# EAGLE design ECU_Checker_New (EAGLE 9.5.2)
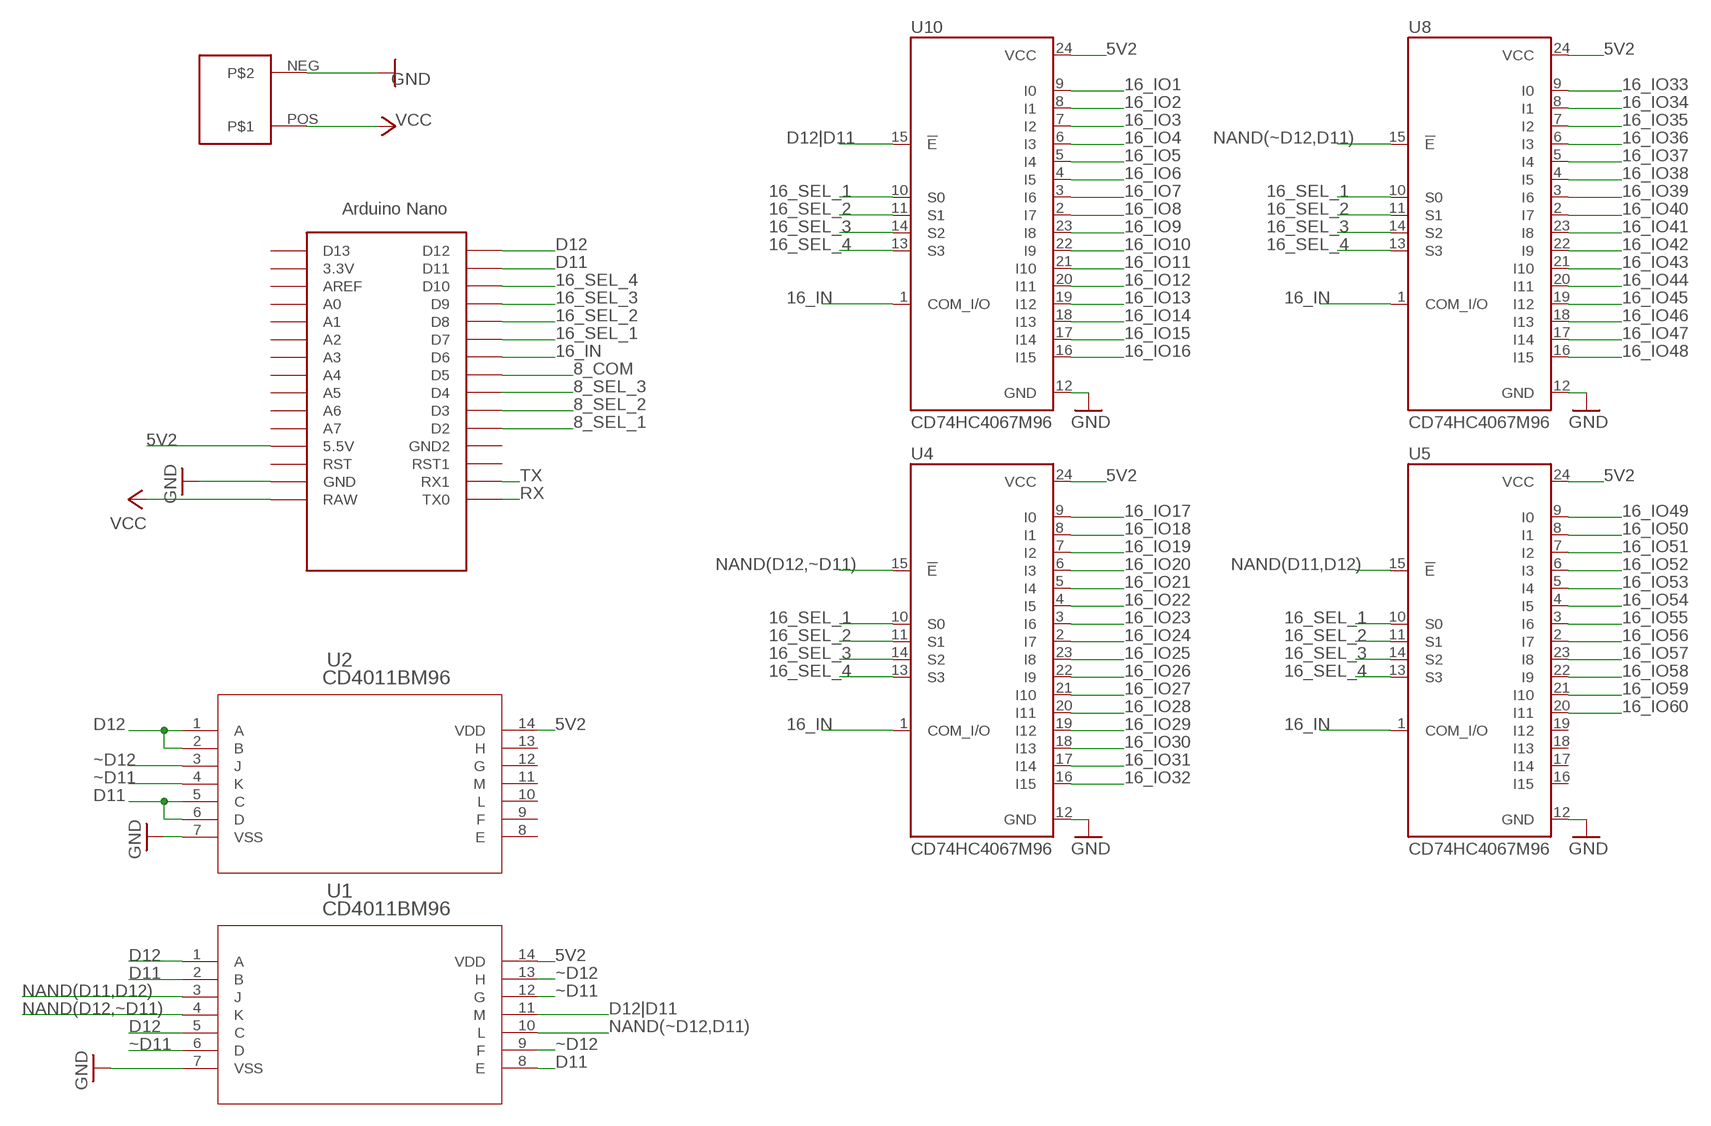
[diagram p0: schematic, sheet 1, part 1 of 2]
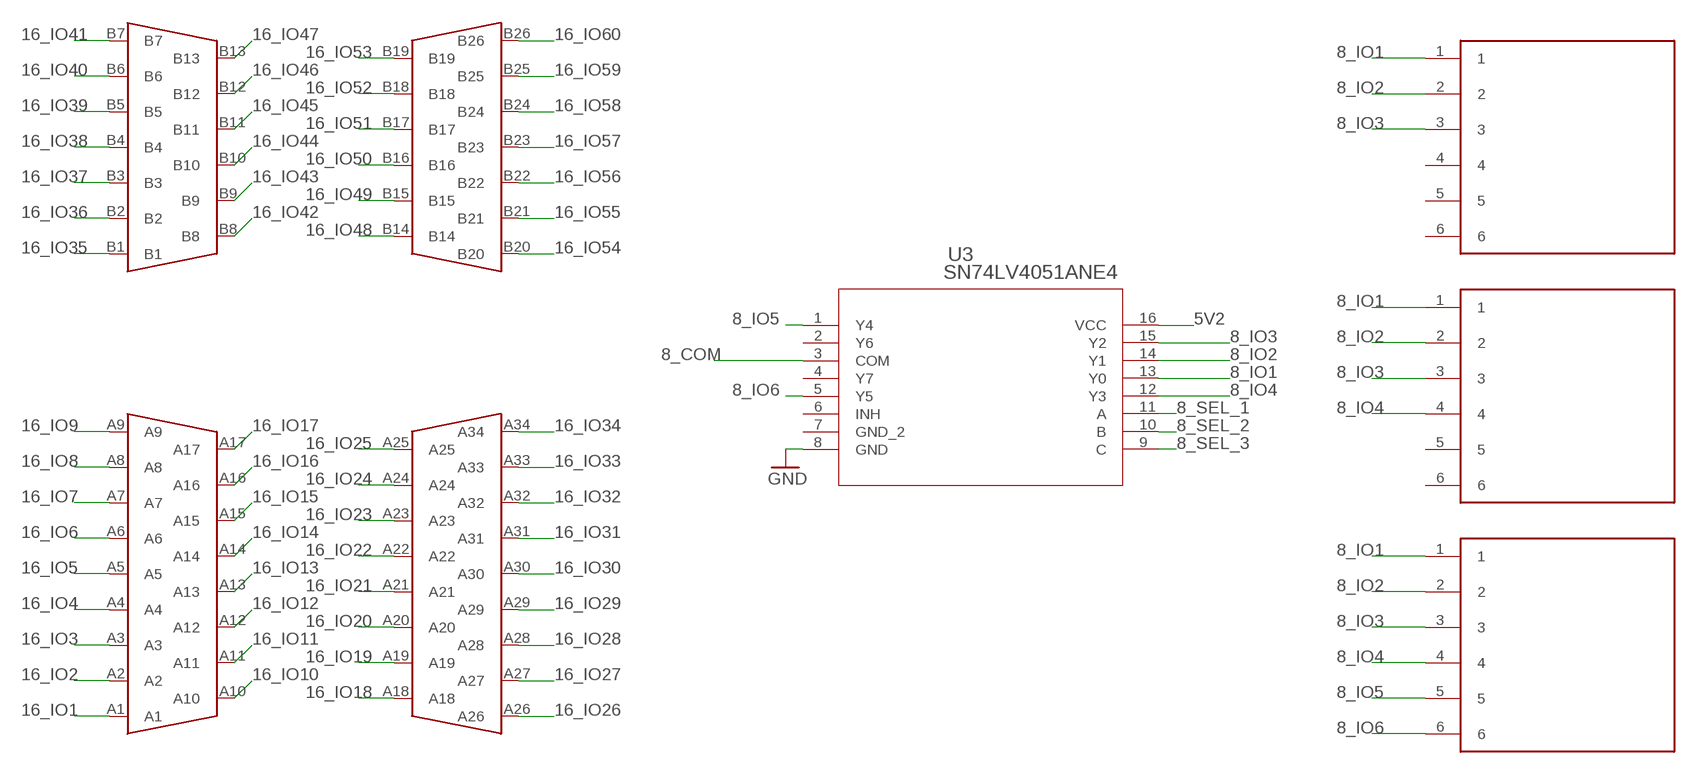
[diagram p1: schematic, sheet 1, part 2 of 2]

## Parts
U1  CD4011BM96  [D14]
U2  CD4011BM96  [D14]
U3  SN74LV4051ANE4  [N16]
U4  CD74HC4067M96  [SOIC127P1030X265-24N]
U5  CD74HC4067M96  [SOIC127P1030X265-24N]
U8  CD74HC4067M96  [SOIC127P1030X265-24N]
U10  CD74HC4067M96  [SOIC127P1030X265-24N]
U$2  NANO  [NANO]
U$3  DTM_CON  [DTM_CON_F]
U$4  BATTERY  [BATTERY_F]
U$5  DTM_CON  [DTM_CON_F]
U$6  DTM_CON  [DTM_CON_F]
U$7  MOTEC_400_CON  [MOTEC_400_CON_F]

## Nets
5V2: U1.14(VDD) U2.14(VDD) U3.16(VCC) U4.24(VCC) U5.24(VCC) U8.24(VCC) U10.24(VCC) U$2.5V(5.5V)
8_COM: U3.3(COM) U$2.D5
8_IO1: U3.13(Y0) U$3.1 U$5.1 U$6.1
8_IO2: U3.14(Y1) U$3.2 U$5.2 U$6.2
8_IO3: U3.15(Y2) U$3.3 U$5.3 U$6.3
8_IO4: U3.12(Y3) U$5.4 U$6.4
8_IO5: U3.1(Y4) U$6.5
8_IO6: U3.5(Y5) U$6.6
8_SEL_1: U3.11(A) U$2.D2
8_SEL_2: U3.10(B) U$2.D3
8_SEL_3: U3.9(C) U$2.D4
16_IN: U4.1(COM_I/O) U5.1(COM_I/O) U8.1(COM_I/O) U10.1(COM_I/O) U$2.D6
16_IO1: U10.9(I0) U$7.A1
16_IO2: U10.8(I1) U$7.A2
16_IO3: U10.7(I2) U$7.A3
16_IO4: U10.6(I3) U$7.A4
16_IO5: U10.5(I4) U$7.A5
16_IO6: U10.4(I5) U$7.A6
16_IO7: U10.3(I6) U$7.A7
16_IO8: U10.2(I7) U$7.A8
16_IO9: U10.23(I8) U$7.A9
16_IO10: U10.22(I9) U$7.A10
16_IO11: U10.21(I10) U$7.A11
16_IO12: U10.20(I11) U$7.A12
16_IO13: U10.19(I12) U$7.A13
16_IO14: U10.18(I13) U$7.A14
16_IO15: U10.17(I14) U$7.A15
16_IO16: U10.16(I15) U$7.A16
16_IO17: U4.9(I0) U$7.A17
16_IO18: U4.8(I1) U$7.A18
16_IO19: U4.7(I2) U$7.A19
16_IO20: U4.6(I3) U$7.A20
16_IO21: U4.5(I4) U$7.A21
16_IO22: U4.4(I5) U$7.A22
16_IO23: U4.3(I6) U$7.A23
16_IO24: U4.2(I7) U$7.A24
16_IO25: U4.23(I8) U$7.A25
16_IO26: U4.22(I9) U$7.A26
16_IO27: U4.21(I10) U$7.A27
16_IO28: U4.20(I11) U$7.A28
16_IO29: U4.19(I12) U$7.A29
16_IO30: U4.18(I13) U$7.A30
16_IO31: U4.17(I14) U$7.A31
16_IO32: U4.16(I15) U$7.A32
16_IO33: U8.9(I0) U$7.A33
16_IO34: U8.8(I1) U$7.A34
16_IO35: U8.7(I2) U$7.B1
16_IO36: U8.6(I3) U$7.B2
16_IO37: U8.5(I4) U$7.B3
16_IO38: U8.4(I5) U$7.B4
16_IO39: U8.3(I6) U$7.B5
16_IO40: U8.2(I7) U$7.B6
16_IO41: U8.23(I8) U$7.B7
16_IO42: U8.22(I9) U$7.B8
16_IO43: U8.21(I10) U$7.B9
16_IO44: U8.20(I11) U$7.B10
16_IO45: U8.19(I12) U$7.B11
16_IO46: U8.18(I13) U$7.B12
16_IO47: U8.17(I14) U$7.B13
16_IO48: U8.16(I15) U$7.B14
16_IO49: U5.9(I0) U$7.B15
16_IO50: U5.8(I1) U$7.B16
16_IO51: U5.7(I2) U$7.B17
16_IO52: U5.6(I3) U$7.B18
16_IO53: U5.5(I4) U$7.B19
16_IO54: U5.4(I5) U$7.B20
16_IO55: U5.3(I6) U$7.B21
16_IO56: U5.2(I7) U$7.B22
16_IO57: U5.23(I8) U$7.B23
16_IO58: U5.22(I9) U$7.B24
16_IO59: U5.21(I10) U$7.B25
16_IO60: U5.20(I11) U$7.B26
16_SEL_1: U4.10(S0) U5.10(S0) U8.10(S0) U10.10(S0) U$2.D7
16_SEL_2: U4.11(S1) U5.11(S1) U8.11(S1) U10.11(S1) U$2.D8
16_SEL_3: U4.14(S2) U5.14(S2) U8.14(S2) U10.14(S2) U$2.D9
16_SEL_4: U4.13(S3) U5.13(S3) U8.13(S3) U10.13(S3) U$2.D10
D11: U1.2(B) U1.8(E) U2.5(C) U2.6(D) U$2.D11
D12: U1.1(A) U1.5(C) U2.1(A) U2.2(B) U$2.D12
D12|D11: U1.11(M) U10.15(!E)
GND: U1.7(VSS) U2.7(VSS) U3.8(GND) U4.12(GND) U5.12(GND) U8.12(GND) U10.12(GND) U$2.GND U$4.NEG
NAND(D11,D12): U1.3(J) U5.15(!E)
NAND(D12,~D11): U1.4(K) U4.15(!E)
NAND(~D12,D11): U1.10(L) U8.15(!E)
RX: U$2.TX0
TX: U$2.RX1
VCC: U$2.RAW U$4.POS
~D11: U1.6(D) U1.12(G) U2.4(K)
~D12: U1.9(F) U1.13(H) U2.3(J)
Unconnected: U2.8(E) U2.9(F) U2.10(L) U2.11(M) U2.12(G) U2.13(H) U3.2(Y6) U3.4(Y7) U3.6(INH) U5.16(I15) U5.17(I14) U5.18(I13) U5.19(I12) U$2.3.3V U$2.A0 U$2.A1 U$2.A2 U$2.A3 U$2.A4 U$2.A5 U$2.A6 U$2.A7 U$2.AREF U$2.D13 U$2.GND1(GND2) U$2.ICSP1 U$2.ICSP2 U$2.ICSP3 U$2.ICSP4 U$2.ICSP5 U$2.ICSP6 U$2.RST U$2.RST1 U$3.4 U$3.5 U$3.6 U$5.5 U$5.6

## Power pins joined to a net without a drawn wire
GND_2: U3.7(GND_2)

## Library data of the parts
U1 U2 = CD4011BM96:CD4011BM96; MANUFACTURER_PART_NUMBER: CD4011BM96; VENDOR: Texas Instruments
U3 = SN74LV4051ANE4:SN74LV4051ANE4; MANUFACTURER_PART_NUMBER: SN74LV4051ANE4; VENDOR: Texas Instruments
U4 U5 U8 U10 = CD74HC4067M96:CD74HC4067M96: High Speed CMOS 16-Channel Analog Multiplexer/Demultiplexer 24-SOIC -55 to 125; AVAILABILITY: Unavailable; DESCRIPTION: High Speed CMOS 16-Channel Analog Multiplexer/Demultiplexer 24-SOIC -55 to 125; MF: Texas Instruments; MP: CD74HC4067M96; PACKAGE: SOIC-24 Texas Instruments; PRICE: None
U$2 = Arduino-clone:NANO: Arduino Nano
U$3 U$5 U$6 = ECU_CHECK_LIB:DTM_CON
U$4 = ECU_CHECK_LIB:BATTERY
U$7 = ECU_CHECK_LIB:MOTEC_400_CON

## Board
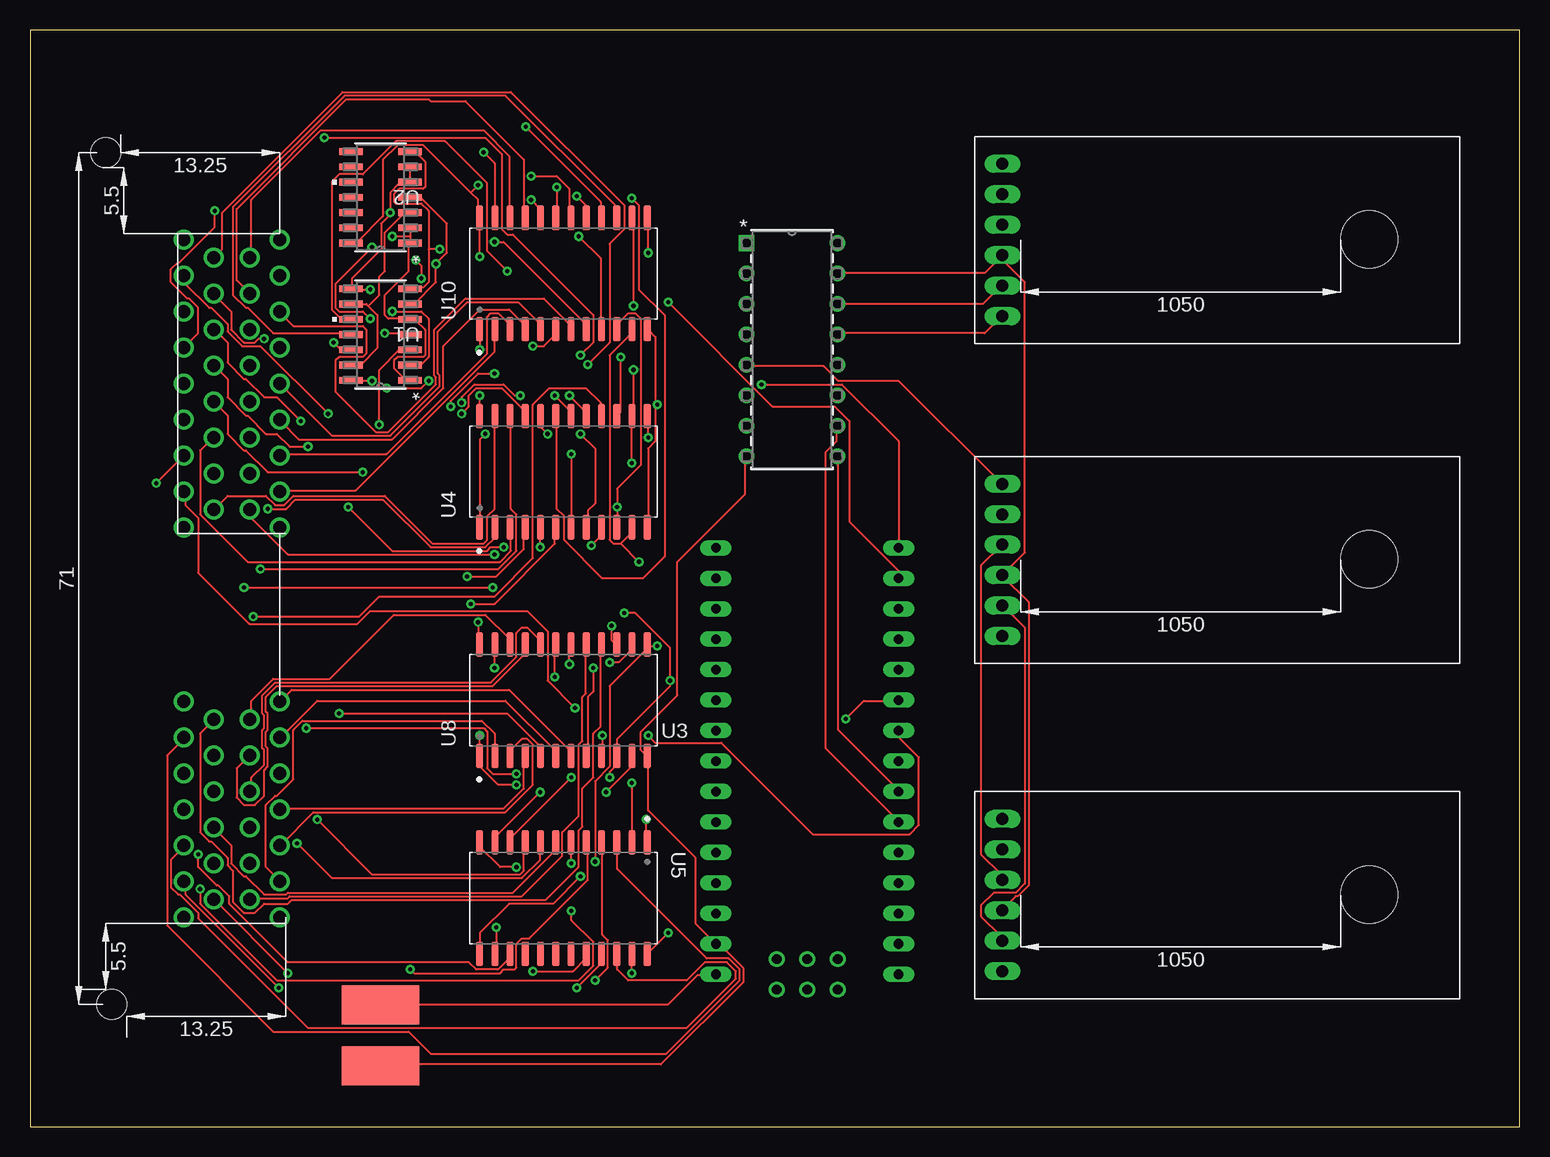
[diagram p2: board, top side]
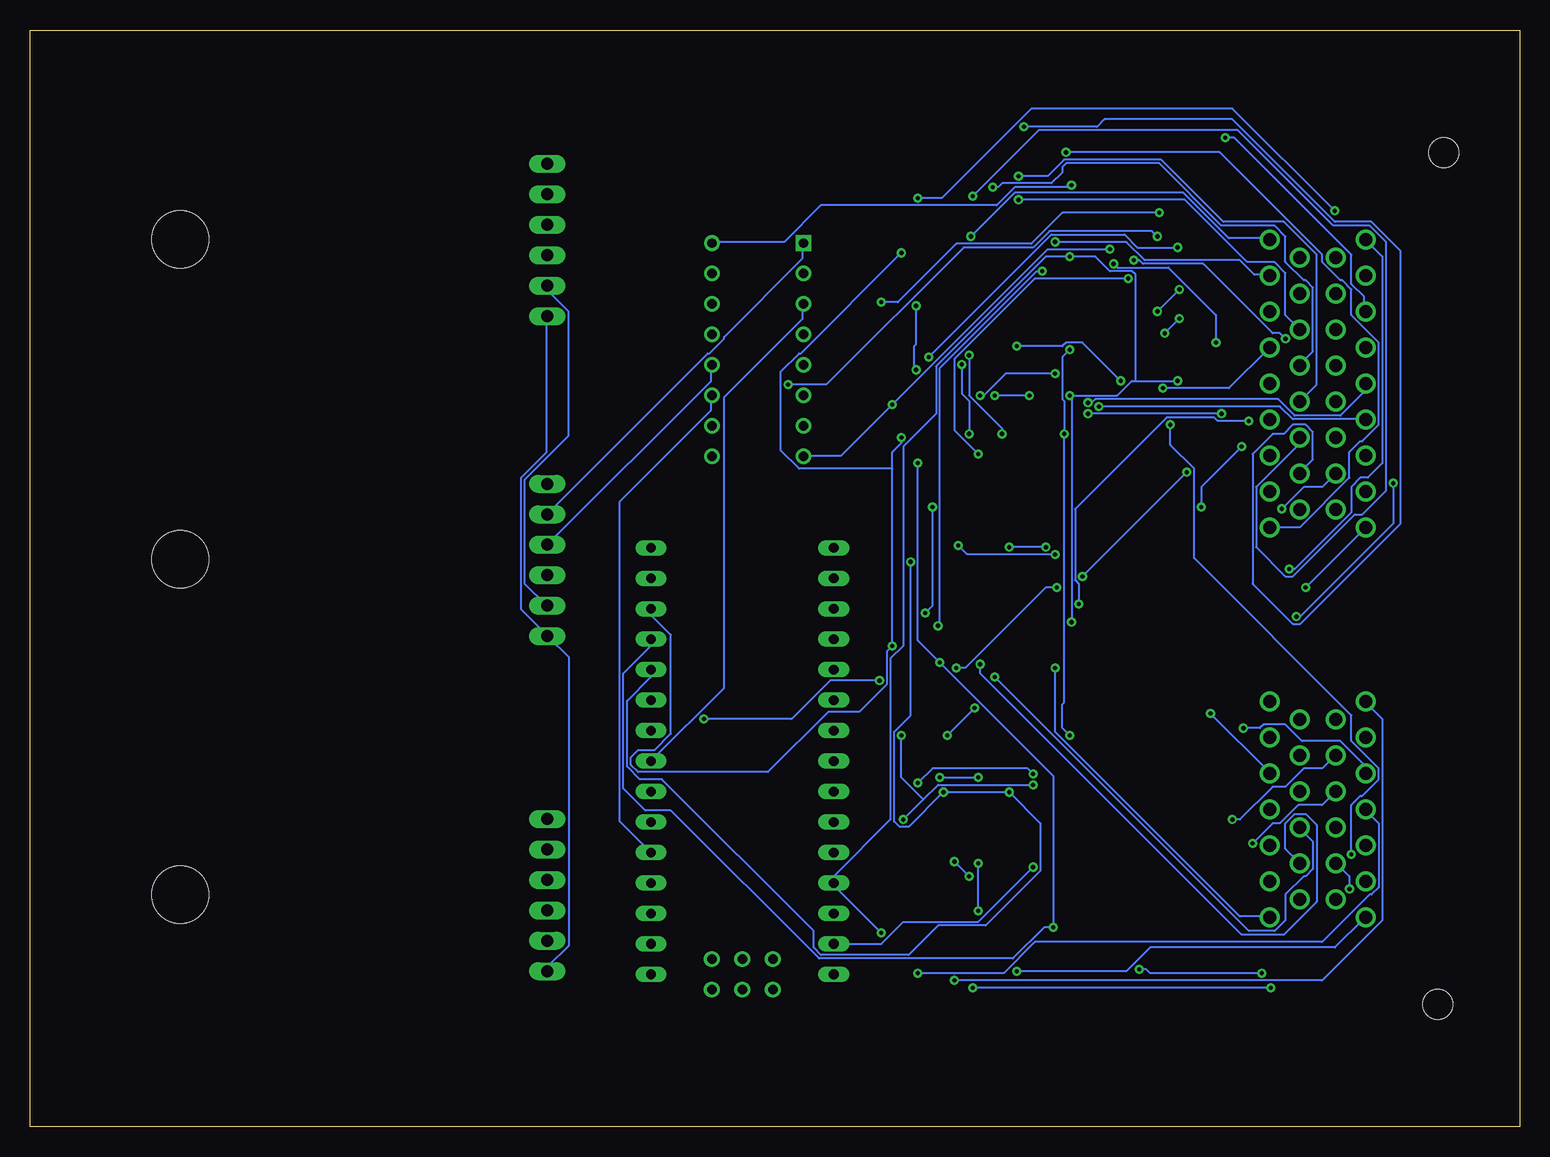
[diagram p3: board, bottom side, seen from below]

Size 124.13 x 91.43 mm. Coordinates in mm from the lower left corner, seen from the top.
Outline: 0,0 124.13,0 124.13,91.43 0,91.43 0,0
Copper layers (1*16): Top 0.035mm / dielectric 1.5mm / Bottom 0.035mm
Design rules "default": minimum track width 6mil, minimum drill 0.35mm, track to track 6mil, track to pad 6mil, pad to pad 6mil, via to via 6mil, smd to smd 6mil, copper to edge 40mil, drill to drill 6mil, minimum pad ring 10mil, minimum via ring 8mil, stop-mask expansion 4mil, vias tented up to drill 0mil, thermal gap 10mil

### Footprints (pad centres in the part's own frame; a part is rotated, then mirrored left to right if it is on the bottom)
D14 = smd 1.981 x 0.559: 1 -2.464,3.81; 2 -2.464,2.54; 3 -2.464,1.27; 4 -2.464,0; 5 -2.464,-1.27; 6 -2.464,-2.54; 7 -2.464,-3.81; 8 2.464,-3.81; 9 2.464,-2.54; 10 2.464,-1.27; 11 2.464,0; 12 2.464,1.27; 13 2.464,2.54; 14 2.464,3.81
N16 = drill 0.787 pad 1.295 square: 1 -7.62,17.78 | drill 0.787 pad 1.295: 2 -7.62,15.24; 3 -7.62,12.7; 4 -7.62,10.16; 5 -7.62,7.62; 6 -7.62,5.08; 7 -7.62,2.54; 8 -7.62,0; 9 0,0; 10 0,2.54; 11 0,5.08; 12 0,7.62; 13 0,10.16; 14 0,12.7; 15 0,15.24; 16 0,17.78
SOIC127P1030X265-24N = smd 2.06 x 0.6: 1 -4.64,6.985; 2 -4.64,5.715; 3 -4.64,4.445; 4 -4.64,3.175; 5 -4.64,1.905; 6 -4.64,0.635; 7 -4.64,-0.635; 8 -4.64,-1.905; 9 -4.64,-3.175; 10 -4.64,-4.445; 11 -4.64,-5.715; 12 -4.64,-6.985; 13 4.64,-6.985; 14 4.64,-5.715; 15 4.64,-4.445; 16 4.64,-3.175; 17 4.64,-1.905; 18 4.64,-0.635; 19 4.64,0.635; 20 4.64,1.905; 21 4.64,3.175; 22 4.64,4.445; 23 4.64,5.715; 24 4.64,6.985
NANO = drill 0.8 long: 3.3V -10.16,24.13; 5V -10.16,-1.27; A0 -10.16,19.05; A1 -10.16,16.51; A2 -10.16,13.97; A3 -10.16,11.43; A4 -10.16,8.89; A5 -10.16,6.35; A6 -10.16,3.81; A7 -10.16,1.27; AREF -10.16,21.59; D2 5.08,1.27; D3 5.08,3.81; D4 5.08,6.35; D5 5.08,8.89; D6 5.08,11.43; D7 5.08,13.97; D8 5.08,16.51; D9 5.08,19.05; D10 5.08,21.59; D11 5.08,24.13; D12 5.08,26.67; D13 -10.16,26.67; GND -10.16,-6.35; GND1 5.08,-1.27; RAW -10.16,-8.89; RST -10.16,-3.81; RST1 5.08,-3.81; RX1 5.08,-6.35; TX0 5.08,-8.89 | drill 0.8: ICSP1 -5.08,-10.16; ICSP2 -5.08,-7.62; ICSP3 -2.54,-10.16; ICSP4 -2.54,-7.62; ICSP5 0,-10.16; ICSP6 0,-7.62
DTM_CON_F = drill 1 long: 1 19.304,6.096; 2 19.304,3.556; 3 19.304,1.016; 4 19.304,-1.524; 5 19.304,-4.064; 6 19.304,-6.604 | hole 4.763: -11.278,-0.305
BATTERY_F = smd 6.452 x 3.251: NEG 0,-2.54; POS 0,2.54
MOTEC_400_CON_F = drill 1.1: A1 13,-0.5; A2 10,-0.5; A3 7,-0.5; A4 4,-0.5; A5 1,-0.5; A6 -2,-0.5; A7 -5,-0.5; A8 -8,-0.5; A9 -11,-0.5; A10 11.5,2; A11 8.5,2; A12 5.5,2; A13 2.5,2; A14 -0.5,2; A15 -3.5,2; A16 -6.5,2; A17 -9.5,2; A18 11.5,5; A19 8.5,5; A20 5.5,5; A21 2.5,5; A22 -0.5,5; A23 -3.5,5; A24 -6.5,5; A25 -9.5,5; A26 13,7.5; A27 10,7.5; A28 7,7.5; A29 4,7.5; A30 1,7.5; A31 -2,7.5; A32 -5,7.5; A33 -8,7.5; A34 -11,7.5; B1 -25.5,-0.5; B2 -28.5,-0.5; B3 -31.5,-0.5; B4 -34.5,-0.5; B5 -37.5,-0.5; B6 -40.5,-0.5; B7 -43.5,-0.5; B8 -27,2; B9 -30,2; B10 -33,2; B11 -36,2; B12 -39,2; B13 -42,2; B14 -27,5; B15 -30,5; B16 -33,5; B17 -36,5; B18 -39,5; B19 -42,5; B20 -25.5,7.5; B21 -28.5,7.5; B22 -31.5,7.5; B23 -34.5,7.5; B24 -37.5,7.5; B25 -40.5,7.5; B26 -43.5,7.5 | hole 2.5: -50.75,13.5; 20.25,14

### Placement (x,y rotation side)
U1  29.21,66.04 180 top
U2  29.21,77.47 180 top
U3  67.31,55.88 0 top
U4  44.45,54.61 90 top
U5  44.45,19.05 270 top
U8  44.45,35.56 90 top
U10  44.45,71.12 90 top
U$2  67.31,21.59 0 top
U$3  100.33,73.66 180 top
U$4  29.21,7.62 0 top
U$5  100.33,19.05 180 top
U$6  100.33,46.99 180 top
U$7  20.32,60.96 90 top

### Tracks (layer width: path | path; a pad name or v marks a point on that pad's centre or on a via)
5V2  (via drill 0.35)
  Top 0.152: 36.73,77.88 37.34,77.27 37.34,75.89 U10.24 37.49,75.74 v37.49,72.54 | 36.73,77.88 32.77,81.84 30.63,81.84 29.41,80.62 29.41,75.89 27.28,73.76 26.82,73.76 U2.14 | 36.73,77.88 v37.34,78.49 | v53.19,16.15 51.51,14.48 U5.24 | v28.5,62.18 26.82,62.18 U1.14 | v37.49,60.96 37.49,59.28 U4.24 | v37.34,42.06 37.34,40.23 U8.24
  Bottom 0.152: v37.34,78.49 37.49,78.33 42.06,78.33 43.59,76.81 58.22,76.81 61.27,73.76 67.21,73.76 U3.16 | v53.19,16.15 57.15,20.12 U$2.5V 57.15,20.88 52.43,25.6 52.43,39.01 51.36,40.08 51.36,56.69 48.62,59.44 48.62,63.4 39.47,72.54 v37.49,72.54 35.36,72.54 34.14,71.32 32.31,71.32 32,71.02 32,62.18 | 32,62.18 32.31,62.18 33.53,60.96 37.34,60.96 | 32,62.18 v28.5,62.18 | 37.34,60.96 v37.34,42.06 | 37.34,60.96 v37.49,60.96
8_COM
  Bottom 0.152: U$2.D5 66.29,36.58 66.29,60.81 59.74,67.36 59.74,68.58 U3.3
8_IO1
  Top 0.152: U3.13 67.36,66.14 79.55,66.14 80.92,67.51 U$3.1
  Bottom 0.152: U$5.1 80.92,12.95 80.92,13.41 79.25,15.09 79.25,39.17 80.92,40.84 U$6.1 81.08,41 83.21,43.13 83.21,54.1 81.08,56.24 81.08,67.51 U$3.1
8_IO2
  Top 0.152: U3.14 79.4,68.58 80.92,70.1 U$3.2 | U$5.2 80.92,15.54 80.92,15.85 79.25,17.53 79.25,18.44 80.31,19.51 82.14,19.51 82.91,20.27 82.91,41.6 81.08,43.43 U$6.2
  Bottom 0.152: U$3.2 80.92,70.1 80.92,69.65 79.25,67.97 79.25,57.61 82.91,53.95 82.91,45.26 81.08,43.43 U$6.2
8_IO3
  Top 0.152: U3.15 67.36,71.17 79.55,71.17 U$3.3 81.08,72.54 81.08,72.24 82.91,70.41 82.91,47.85 U$6.3 81.08,45.87 83.21,43.74 83.21,20.12 82.3,19.2 82.14,19.2 81.08,18.14 U$5.3
8_IO4
  Top 0.152: U$5.4 80.92,20.57 80.92,21.03 79.25,22.71 79.25,46.79 80.92,48.46 U$6.4
  Bottom 0.152: U$6.4 67.36,62.18 67.36,63.4 U3.12
8_IO5
  Bottom 0.152: U3.1 59.74,73.61 59.74,72.39 66.29,65.84 66.29,65.68 67.51,64.47 67.67,64.47 81.08,51.05 U$6.5
8_IO6
  Top 0.152: U3.5 59.74,63.4 66.14,63.4 67.36,62.18 72.39,62.18 80.92,53.65 U$6.6
8_SEL_1
  Bottom 0.152: U$2.D2 74.98,25.45 74.98,52.12 67.36,59.74 67.36,60.96 U3.11
8_SEL_2
  Top 0.152: U3.10 67.21,58.37 67.21,57.15 66.29,56.24 66.29,31.55 72.39,25.45 U$2.D3
8_SEL_3
  Top 0.152: U3.9 67.36,55.78 67.36,33.07 72.39,28.04 U$2.D4
16_IN  (via drill 0.35)
  Top 0.152: v37.95,57.76 37.49,57.3 37.49,49.99 U4.1 | v37.49,64.77 37.49,66.45 U10.1 | v40.54,28.5 39.01,28.5 37.49,30.02 37.49,30.79 U8.1 37.49,30.94 v37.49,32.61 | v51.36,25.6 51.36,23.77 U5.1 | U$2.D6 72.39,32.46 74.07,30.79 74.07,25.15 73.3,24.38 65.23,24.38 57.61,32 52.12,32 v51.51,32.61
  Bottom 0.152: v37.49,64.77 38.1,64.16 38.1,60.66 37.95,60.5 v37.95,57.76 37.95,35.36 38.1,35.2 38.1,33.22 v37.49,32.61 | v40.54,28.5 48.46,28.5 49.68,27.28 | v51.36,25.6 49.68,27.28 | v51.51,32.61 51.51,29.11 49.68,27.28
16_IO1  (via drill 0.35)
  Top 0.152: v45.72,74.22 47.55,72.39 47.55,66.6 U10.9
  Bottom 0.152: v45.72,74.22 42.06,77.88 28.04,77.88 24.23,74.07 20.88,74.07 U$7.A1
16_IO2  (via drill 0.35)
  Top 0.152: v38.71,73.76 39.47,73.76 46.33,66.9 46.33,66.6 U10.8
  Bottom 0.152: v38.71,73.76 32.77,73.76 31.24,72.24 23.32,72.24 22.1,71.02 20.88,71.02 U$7.A2
16_IO3
  Top 0.152: U10.7 44.96,66.6 44.96,66.9 42.82,69.04 36.27,69.04 33.68,66.45 33.68,62.64 33.83,62.48 33.83,61.87 29.87,57.91 28.8,57.91 25.45,61.27 25.45,63.86 25.76,64.16 27.74,64.16 28.04,64.47 28.04,66.45 27.74,66.75 21.95,66.75 20.88,67.82 U$7.A3
16_IO4  (via drill 0.35)
  Top 0.152: v41.91,65.08 42.82,65.08 43.74,65.99 43.74,66.45 U10.6 | v33.22,62.18 32.61,61.57 v29.72,61.57
  Bottom 0.152: v41.91,65.08 38.1,65.08 37.8,65.38 36.42,65.38 v33.22,62.18 | v29.72,61.57 24.23,61.57 20.88,64.92 U$7.A4
16_IO5
  Top 0.152: U10.5 42.52,66.6 42.52,66.9 40.69,68.73 36.42,68.73 33.98,66.29 33.98,62.79 34.14,62.64 34.14,61.72 30.02,57.61 25.15,57.61 20.88,61.87 U$7.A5
16_IO6
  Top 0.152: U10.4 41.15,66.6 41.15,66.9 39.93,68.12 37.49,68.12 34.44,65.08 34.44,61.57 30.18,57.3 22.4,57.3 20.88,58.83 U$7.A6
16_IO7
  Top 0.152: U10.3 39.93,66.6 39.93,66.9 39.01,67.82 38.41,67.82 38.1,67.51 38.1,64.47 29.72,56.08 20.88,56.08 U$7.A7
16_IO8
  Top 0.152: U10.2 38.71,66.45 38.71,64.62 27.13,53.03 20.88,53.03 U$7.A8
16_IO9  (via drill 0.35)
  Top 0.152: v37.8,81.23 38.71,80.31 38.71,75.89 U10.23
  Bottom 0.152: v37.8,81.23 24.99,81.23 16.46,72.69 16.46,72.08 14.94,70.56 14.78,70.56 14.02,69.8 14.02,67.67 11.73,65.38 11.73,58.52 13.11,57.15 13.26,57.15 14.17,56.24 14.17,54.1 18.29,49.99 20.73,49.99 U$7.A9
16_IO10
  Top 0.152: U10.22 39.93,75.89 39.93,80.92 37.8,83.06 24.23,83.06 18.44,77.27 18.44,72.54 U$7.A10
16_IO11
  Top 0.152: U10.21 41.15,75.89 41.15,80.62 36.27,85.5 33.38,85.5 33.22,85.65 26.36,85.65 17.22,76.5 17.22,70.56 18.29,69.49 U$7.A11
16_IO12  (via drill 0.35)
  Top 0.152: v41.76,77.27 42.52,76.5 42.52,75.89 U10.20
  Bottom 0.152: v41.76,77.27 27.89,77.27 22.71,72.08 20.42,72.08 19.51,71.17 19.51,67.67 18.44,66.6 U$7.A12
16_IO13  (via drill 0.35)
  Top 0.152: v43.89,78.33 43.89,75.89 U10.19
  Bottom 0.152: v43.89,78.33 43.43,78.33 43.13,78.64 39.01,78.64 38.1,79.55 38.1,80.01 37.8,80.31 30.02,80.31 24.84,75.13 20.42,75.13 19.51,74.22 19.51,72.08 17.98,70.56 17.83,70.56 17.22,69.95 17.22,64.62 18.29,63.55 U$7.A13
16_IO14  (via drill 0.35)
  Top 0.152: v41.76,79.25 43.89,79.25 44.96,78.18 44.96,75.89 U10.18
  Bottom 0.152: v41.76,79.25 39.32,79.25 37.95,80.62 29.87,80.62 24.69,75.44 19.66,75.44 16.92,72.69 16.92,61.87 18.29,60.5 U$7.A14
16_IO15  (via drill 0.35)
  Top 0.152: v45.57,77.57 46.33,76.81 46.33,75.89 U10.17
  Bottom 0.152: v45.57,77.57 40.08,83.06 23.47,83.06 15.54,75.13 12.5,75.13 11.12,73.76 11.12,53.03 13.11,51.05 13.72,51.05 18.9,45.87 19.51,45.87 21.95,48.31 21.95,53.34 18.44,56.84 18.44,57.45 U$7.A15
16_IO16  (via drill 0.35)
  Top 0.152: v41.3,83.36 47.55,77.11 47.55,75.89 U10.16
  Bottom 0.152: v41.3,83.36 35.2,83.36 34.59,83.97 23.93,83.97 15.39,75.44 12.34,75.44 9.91,73 9.91,50.29 18.29,41.91 18.9,41.91 22.25,45.26 22.25,56.08 20.57,57.76 19.66,57.76 18.9,58.52 17.83,58.52 17.22,57.91 17.22,55.63 18.29,54.56 U$7.A16
16_IO17  (via drill 0.35)
  Top 0.152: v46.79,48.46 47.55,49.23 47.55,49.84 U4.9 | v38.71,47.7 21.49,47.7 18.44,50.75 18.44,51.36 U$7.A17
  Bottom 0.152: v46.79,48.46 46.02,47.7 v38.71,47.7
16_IO18  (via drill 0.35)
  Top 0.152: v45.87,57.76 47.09,56.54 47.09,51.97 46.48,51.36 46.48,49.99 U4.8 | v46.48,63.55 48.31,65.38 48.31,73.61 49.53,74.83 49.53,76.81 40.08,86.26 26.06,86.26 16,76.2 16,73.15 15.39,72.54 U$7.A18
  Bottom 0.152: v45.87,57.76 45.87,60.5 46.48,61.11 v46.48,63.55
16_IO19  (via drill 0.35)
  Top 0.152: v45.11,56.08 45.11,49.99 U4.7 | v32.61,70.71 32.61,71.78 v32.16,72.24 | v19.51,65.68 19.05,65.68 18.75,65.38 17.83,65.38 16.76,66.45 16.76,67.97 15.39,69.34 U$7.A19
  Bottom 0.152: v45.11,56.08 47.09,58.06 47.09,64.01 40.39,70.71 v32.61,70.71 | v32.16,72.24 31.7,72.24 31.39,71.93 26.36,71.93 20.57,66.14 19.96,66.14 v19.51,65.68
16_IO20  (via drill 0.35)
  Top 0.152: v36.73,43.59 38.71,43.59 43.74,48.62 43.74,49.84 U4.6 | v22.55,58.83 20.57,60.81 19.51,60.81 17.98,62.33 17.83,62.33 16.46,63.7 16.46,65.38 15.39,66.45 U$7.A20
  Bottom 0.152: v36.73,43.59 36.73,45.26 37.03,45.57 37.03,51.51 29.41,59.13 25.45,59.13 25.15,58.83 v22.55,58.83
16_IO21  (via drill 0.35)
  Top 0.152: v42.52,48.31 42.52,49.84 U4.5 | v39.47,48.31 38.41,48.31 38.1,48.01 30.18,48.01 v26.52,51.66 | v23.16,56.69 21.64,56.69 20.57,57.76 19.66,57.76 18.14,59.28 17.98,59.28 16.46,60.81 16.46,62.33 15.39,63.4 U$7.A21
  Bottom 0.152: v39.47,48.31 v42.52,48.31 | v26.52,51.66 26.52,53.34 v23.16,56.69
16_IO22  (via drill 0.35)
  Top 0.152: v36.42,45.87 38.86,45.87 41.15,48.16 41.15,49.84 U4.4 | v27.74,54.56 19.81,54.56 17.98,56.39 17.83,56.39 16.46,57.76 16.46,59.28 15.39,60.35 U$7.A22
  Bottom 0.152: v27.74,54.56 v36.42,45.87
16_IO23
  Top 0.152: U4.3 40.08,49.84 40.08,48.01 39.17,47.09 18.14,47.09 14.17,51.05 14.17,56.39 15.24,57.45 U$7.A23
16_IO24  (via drill 0.35)
  Top 0.152: v19.81,51.51 21.34,51.51 22.1,52.27 29.41,52.27 33.38,48.31 37.95,48.31 38.71,49.07 38.71,49.84 U4.2
  Bottom 0.152: v19.81,51.51 17.98,53.34 16.46,53.34 15.39,54.41 U$7.A24
16_IO25
  Top 0.152: U4.23 38.71,59.13 38.71,51.51 38.1,50.9 38.1,48.92 37.8,48.62 33.53,48.62 29.57,52.58 21.95,52.58 21.18,51.82 20.42,51.82 19.66,52.58 16.46,52.58 15.39,51.51 U$7.A25
16_IO26  (via drill 0.35)
  Top 0.152: v19.2,46.48 39.01,46.48 40.54,48.01 40.54,51.05 40.08,51.51 40.08,59.13 U4.22
  Bottom 0.152: v19.2,46.48 18.75,46.48 14.02,51.21 14.02,53.34 13.26,54.1 12.65,54.1 11.43,55.32 11.43,72.54 12.8,73.91 U$7.A26
16_IO27  (via drill 0.35)
  Top 0.152: v35.97,59.44 36.58,60.05 36.58,60.96 37.19,61.57 39.32,61.57 41.15,59.74 41.15,59.28 U4.21 | v24.84,59.44 19.2,65.08 17.68,65.08 16.46,66.29 16.46,66.9 15.09,68.28 14.94,68.28 12.95,70.26 12.95,70.87 U$7.A27
  Bottom 0.152: v24.84,59.44 v35.97,59.44
16_IO28  (via drill 0.35)
  Top 0.152: v43.13,57.76 42.67,58.22 42.67,59.13 U4.20 | v45.87,64.31 46.94,65.38 46.94,67.67 40.23,74.37 39.78,74.37 39.32,74.83 39.32,81.08 37.95,82.45 v24.54,82.45
  Bottom 0.152: v43.13,57.76 43.13,58.22 45.87,60.96 v45.87,64.31 | v24.54,82.45 23.77,82.45 14.02,72.69 14.02,70.26 12.95,69.19 12.95,67.97 U$7.A28
16_IO29  (via drill 0.35)
  Top 0.152: v50.14,77.42 50.75,76.81 50.75,69.8 52.88,67.67 52.88,47.55 51.05,45.72 47.7,45.72 44.5,48.92 44.5,50.9 43.89,51.51 43.89,59.13 U4.19 | v15.39,76.35 15.39,74.98 12.5,72.08 12.34,72.08 11.73,71.48 11.73,70.41 13.11,69.04 13.26,69.04 14.02,68.28 14.02,66.14 12.95,65.08 U$7.A29
  Bottom 0.152: v50.14,77.42 48.16,77.42 40.69,84.89 23.93,84.89 v15.39,76.35
16_IO30  (via drill 0.35)
  Top 0.152: v43.74,60.96 44.96,59.74 44.96,59.28 U4.18 | v40.84,60.96 40.39,60.96 39.47,61.87 37.03,61.87 35.97,60.81 v35.97,60.35
  Bottom 0.152: v40.84,60.96 v43.74,60.96 | v35.97,60.35 35.66,60.35 35.36,60.66 20.12,60.66 18.75,59.28 14.94,59.28 12.95,61.27 12.95,61.87 U$7.A30
16_IO31  (via drill 0.35)
  Top 0.152: v44.96,60.96 46.33,59.59 46.33,59.28 U4.17 | v38.71,62.79 37.34,62.79 35.05,60.5 v35.05,60.05
  Bottom 0.152: v44.96,60.96 44.65,60.96 42.82,62.79 v38.71,62.79 | v35.05,60.05 19.96,60.05 18.9,58.98 12.95,58.98 U$7.A31
16_IO32  (via drill 0.35)
  Top 0.152: v18.59,42.52 27.43,42.52 29.11,44.2 38.71,44.2 41.91,47.4 41.91,60.2 43.28,61.57 46.33,61.57 47.55,60.35 47.55,59.28 U4.16 | v10.52,53.65 12.8,55.93 U$7.A32
  Bottom 0.152: v18.59,42.52 18.29,42.52 10.52,50.29 v10.52,53.65
16_IO33  (via drill 0.35)
  Top 0.152: v47.7,32.61 47.7,30.94 U8.9 | v45.41,34.9 43.13,37.19 43.13,41.3 41.45,42.98 28.35,42.98 27.28,41.91 18.29,41.91 14.02,46.18 14.02,50.75 12.95,51.82 12.95,52.88 U$7.A33
  Bottom 0.152: v45.41,34.9 v47.7,32.61
16_IO34  (via drill 0.35)
  Top 0.152: v46.94,38.25 46.94,36.27 46.48,35.81 46.48,30.94 U8.8 | v17.83,44.96 v38.56,44.96
  Bottom 0.152: v46.94,38.25 46.18,38.25 39.47,44.96 v38.56,44.96 | v17.83,44.96 12.95,49.84 U$7.A34
16_IO35
  Top 0.152: U8.7 44.96,30.94 44.96,31.39 39.93,36.42 21.79,36.42 20.88,35.51 U$7.B1
16_IO36
  Top 0.152: U8.6 43.74,30.94 43.74,31.39 39.62,35.51 23.93,35.51 20.88,32.46 U$7.B2
16_IO37  (via drill 0.35)
  Top 0.152: v25.76,34.44 39.78,34.44 42.52,31.7 42.52,30.94 U8.5
  Bottom 0.152: v25.76,34.44 20.88,29.57 U$7.B3
16_IO38
  Top 0.152: U8.4 41.15,30.79 41.15,28.19 39.47,26.52 20.88,26.52 U$7.B4
16_IO39
  Top 0.152: U8.3 40.08,30.94 40.08,31.39 41,32.31 41.45,32.31 41.91,31.85 41.91,28.5 39.62,26.21 23.62,26.21 20.88,23.47 U$7.B5
16_IO40
  Top 0.152: U8.2 38.71,30.94 38.71,32.77 37.64,33.83 22.71,33.83 21.95,33.07 21.95,28.96 20.57,27.58 20.42,27.58 19.66,26.82 19.66,21.64 20.73,20.57 U$7.B6
16_IO41  (via drill 0.35)
  Top 0.152: v38.71,38.25 38.71,40.08 U8.23
  Bottom 0.152: v38.71,38.25 38.71,32.92 23.32,17.53 20.88,17.53 U$7.B7
16_IO42
  Top 0.152: U8.22 39.93,40.23 39.93,40.69 37.95,42.67 30.33,42.67 24.99,37.34 20.27,37.34 18.44,35.51 18.44,33.98 U$7.B8
16_IO43
  Top 0.152: U8.21 41.15,40.08 41.15,39.32 38.56,36.73 20.57,36.73 19.66,35.81 19.66,34.59 19.81,34.44 19.81,33.07 19.66,32.92 19.66,31.7 19.81,31.55 19.81,30.02 19.51,29.72 19.51,27.58 18.75,26.82 17.83,26.82 17.22,27.43 17.22,29.87 18.29,30.94 U$7.B9
16_IO44
  Top 0.152: U8.20 42.52,40.23 42.52,40.54 41.45,41.6 41,41.6 40.54,41.15 40.54,39.17 38.41,37.03 20.42,37.03 19.36,35.97 19.36,34.44 19.51,34.29 19.51,33.22 19.36,33.07 19.36,31.55 19.51,31.39 19.51,30.18 18.44,29.11 18.44,28.04 U$7.B10
16_IO45  (via drill 0.35)
  Top 0.152: v43.74,37.49 43.74,40.08 U8.19
  Bottom 0.152: v43.74,37.49 22.55,16.31 20.42,16.31 19.51,17.22 19.51,19.36 17.98,20.88 17.83,20.88 17.22,21.49 17.22,23.77 18.29,24.84 U$7.B11
16_IO46  (via drill 0.35)
  Top 0.152: v44.96,38.56 44.96,40.08 U8.18
  Bottom 0.152: v44.96,38.56 44.96,37.8 23.16,16 19.66,16 16.92,18.75 16.92,25.15 17.83,26.06 18.75,26.06 19.51,25.3 19.51,23.16 18.44,22.1 U$7.B12
16_IO47
  Top 0.152: U8.17 46.33,40.08 46.33,36.12 46.02,35.81 46.02,32.16 45.72,31.85 45.72,25.91 44.35,24.54 44.35,22.55 41,19.2 21.64,19.2 21.49,19.05 18.44,19.05 U$7.B13
16_IO48
  Top 0.152: U8.16 47.55,40.08 47.55,33.38 46.94,32.77 46.94,29.11 46.02,28.19 46.02,24.99 45.72,24.69 45.72,21.64 42.98,18.9 21.79,18.9 21.49,18.59 19.51,18.59 18.75,17.83 17.83,17.83 16.92,18.75 16.92,21.34 16.46,21.79 16.46,22.4 15.09,23.77 14.94,23.77 14.17,24.54 14.17,32.77 15.24,33.83 U$7.B14
16_IO49  (via drill 0.35)
  Top 0.152: v23.93,25.6 28.5,21.03 40.84,21.03 41.15,21.34 41.15,23.62 U5.9
  Bottom 0.152: v23.93,25.6 23.32,25.6 20.57,28.35 19.51,28.35 17.98,29.87 16.46,29.87 15.39,30.94 U$7.B15
16_IO50  (via drill 0.35)
  Top 0.152: v22.25,23.62 25.15,20.73 41,20.73 42.52,22.25 42.52,23.62 U5.8
  Bottom 0.152: v22.25,23.62 20.57,25.3 19.96,25.3 18.44,26.82 16.46,26.82 15.39,27.89 U$7.B16
16_IO51
  Top 0.152: U5.7 43.74,23.62 43.74,23.01 40.23,19.51 21.49,19.51 21.34,19.36 19.51,19.36 17.98,20.88 17.83,20.88 16.76,21.95 16.76,23.47 15.39,24.84 U$7.B17
16_IO52  (via drill 0.35)
  Top 0.152: v45.11,21.95 45.11,23.62 U5.6 | v45.11,17.98 45.11,17.22 46.94,15.39 46.94,13.41 45.72,12.19 20.57,12.19 14.17,18.59 v14.17,19.81
  Bottom 0.152: v45.11,17.98 v45.11,21.95 | v14.17,19.81 14.17,20.88 15.24,21.95 U$7.B18
16_IO53  (via drill 0.35)
  Top 0.152: v31.7,13.11 32,12.8 39.17,12.8 39.47,13.11 40.39,13.11 40.54,13.26 40.54,15.24 41,15.7 41.6,15.7 46.48,20.57 46.48,23.62 U5.5 | v21.49,12.8 15.39,18.9 U$7.B19
  Bottom 0.152: v31.7,13.11 31.09,13.11 30.79,12.8 v21.49,12.8
16_IO54  (via drill 0.35)
  Top 0.152: v47.09,12.19 48.16,13.26 48.16,15.54 47.7,16 47.7,23.62 U5.4
  Bottom 0.152: v47.09,12.19 16.46,12.19 11.43,17.22 11.43,33.98 12.8,35.36 U$7.B20
16_IO55
  Top 0.152: U5.3 48.92,23.62 48.92,21.49 56.39,14.02 58.22,14.02 59.13,13.11 59.13,12.19 53.03,6.1 33.38,6.1 31.55,7.92 20.27,7.92 11.43,16.76 11.43,30.94 12.8,32.31 U$7.B21
16_IO56  (via drill 0.35)
  Top 0.152: v50.14,28.65 50.14,23.77 U5.2 | v40.54,29.41 38.56,29.41 38.1,29.87 38.1,32.92 37.8,33.22 v23.01,33.22
  Bottom 0.152: v50.14,28.65 48.92,29.87 41,29.87 v40.54,29.41 | v23.01,33.22 21.64,33.22 21.34,33.53 19.51,33.53 18.14,32.16 14.94,32.16 12.95,30.18 12.95,29.57 U$7.B22
16_IO57  (via drill 0.35)
  Top 0.152: v50.14,12.8 50.14,14.33 U5.23
  Bottom 0.152: v50.14,12.8 42.98,12.8 40.39,15.39 16.46,15.39 12.5,19.36 12.34,19.36 11.73,19.96 11.73,25.3 12.8,26.36 U$7.B23
16_IO58
  Top 0.152: U5.22 48.92,14.33 48.92,13.11 49.84,12.19 54.71,12.19 56.24,13.72 58.06,13.72 58.83,12.95 58.83,12.34 54.71,8.23 23.16,8.23 14.02,17.37 14.02,17.83 12.5,19.36 12.34,19.36 11.73,19.96 11.73,22.25 12.8,23.32 U$7.B24
16_IO59  (via drill 0.35)
  Top 0.152: v45.57,11.58 47.55,13.56 47.55,14.33 U5.21 | v20.73,11.58 12.95,19.36 12.95,20.42 U$7.B25
  Bottom 0.152: v20.73,11.58 v45.57,11.58
16_IO60  (via drill 0.35)
  Top 0.152: v41.91,12.95 45.26,12.95 46.33,14.02 46.33,14.33 U5.20
  Bottom 0.152: v41.91,12.95 32.77,12.95 30.79,14.94 15.39,14.94 12.95,17.37 U$7.B26
16_SEL_1  (via drill 0.35)
  Top 0.152: U4.10 48.92,49.99 v48.92,51.66 48.92,53.19 50.9,55.17 50.9,67.36 50.44,67.82 49.84,67.82 48.92,66.9 48.92,66.6 U10.10 | v45.11,29.11 40.08,24.08 40.08,23.77 U5.10 | v48.31,29.11 48.31,29.57 48.77,30.02 48.77,30.79 U8.10 48.92,30.94 48.92,32.31 53.34,36.73 v53.34,37.19 53.34,39.93 50.44,42.82 v49.53,42.82 | v67.97,33.98 69.49,35.51 72.39,35.51 U$2.D7
  Bottom 0.152: v48.31,29.11 v45.11,29.11 | v67.97,33.98 60.66,33.98 57.45,37.19 v53.34,37.19 | v48.92,51.66 48.92,43.43 v49.53,42.82
16_SEL_2  (via drill 0.35)
  Top 0.152: 49.23,48.62 50.14,49.53 50.14,49.84 U4.11 | 49.23,48.62 48.62,48.62 48.31,48.92 48.31,64.31 50.14,66.14 50.14,66.45 U10.11 | v42.52,27.89 38.86,24.23 38.86,23.77 U5.11 | v48.01,27.89 50.14,30.02 50.14,30.79 U8.11 | v50.75,47.09 49.23,48.62
  Bottom 0.152: U$2.D8 72.39,37.49 74.37,35.51 74.37,30.02 73.3,28.96 71.48,28.96 58.83,16.31 58.83,14.94 58.22,14.33 50.9,14.33 48.46,16.76 44.5,16.76 39.93,21.34 39.93,25.3 v42.52,27.89 v48.01,27.89 50.9,24.99 51.66,24.99 52.12,25.45 52.12,32.92 50.75,34.29 v50.75,47.09
16_SEL_3  (via drill 0.35)
  Top 0.152: v38.86,16.61 38.86,14.48 U5.14 | v48.31,38.71 49.07,38.71 50.14,39.78 50.14,40.08 U8.14 | v50.14,55.32 50.14,59.13 U4.14 50.29,59.28 v50.29,63.09 | v50.29,68.43 50.29,75.74 U10.14
  Bottom 0.152: v50.14,55.32 50.14,40.54 v48.31,38.71 38.86,29.26 v38.86,16.61 39.62,16.61 42.22,14.02 58.37,14.02 70.71,26.36 72.85,26.36 74.68,28.19 74.68,37.8 72.39,40.08 U$2.D9 | v50.29,68.43 50.29,65.23 50.44,65.08 50.44,63.25 v50.29,63.09
16_SEL_4  (via drill 0.35)
  Top 0.152: v45.87,20.88 43.59,18.59 39.93,18.59 37.49,16.15 37.49,14.48 U5.13 | v47.09,22.1 47.09,28.8 48.31,30.02 48.31,36.73 51.36,39.78 51.36,40.08 U8.13 51.51,40.08 v52.27,40.08 | v51.51,57.45 51.51,59.13 U4.13 | v51.51,72.85 51.51,75.74 U10.13
  Bottom 0.152: v47.09,22.1 v45.87,20.88 | v51.51,57.45 51.51,57 52.27,56.24 52.27,54.86 | 52.27,54.86 v52.27,40.08 52.73,39.62 52.73,36.88 55.02,34.59 57.61,34.59 62.64,29.57 73.46,29.57 74.07,30.18 74.07,30.79 73.46,31.39 72.08,31.39 70.71,32.77 70.71,41 72.39,42.67 U$2.D10 | v51.51,72.85 59.89,64.47 60.05,64.47 61.57,62.94 61.57,56.39 60.05,54.86 52.27,54.86
D11  (via drill 0.35)
  Top 0.152: v30.18,67.97 32.61,67.97 33.22,67.36 33.22,64.16 32.61,63.55 31.7,63.55 U1.2 | v28.35,69.8 26.82,69.8 U1.8 26.82,69.95 26.82,70.71 29.26,73.15 29.26,75.29 30.02,76.05 v30.02,76.2 30.02,77.88 30.79,78.64 31.55,78.64 U2.5 31.7,78.79 31.7,80.01 U2.6 | U$2.D11 72.39,46.33 68.28,50.44 68.28,58.83 67.06,60.05 61.87,60.05 v53.19,68.73
  Bottom 0.152: v28.35,69.8 v30.18,67.97 | v53.19,68.73 51.82,68.73 46.94,73.61 40.69,73.61 38.1,76.2 v30.02,76.2
D12  (via drill 0.35)
  Top 0.152: 31.7,74.22 31.7,74.83 U2.2 | 31.7,74.22 31.7,73.76 U2.1 31.55,73.61 31.55,71.32 29.57,69.34 29.57,67.67 29.87,67.36 31.55,67.36 U1.5 31.7,67.21 32.16,67.21 32.92,66.45 32.92,64.31 32.77,64.16 30.63,64.16 30.33,63.86 30.33,63.25 31.24,62.33 31.55,62.33 U1.1 | U$2.D12 72.39,57.15 67.67,61.87 v60.96,61.87 | 31.7,74.22 v30.18,74.22
  Bottom 0.152: v60.96,61.87 57.76,61.87 46.33,73.3 40.54,73.3 39.17,74.68 30.63,74.68 v30.18,74.22
D12|D11
  Top 0.152: U1.11 26.67,66.14 20.27,66.14 18.14,68.28 17.98,68.28 16.92,69.34 16.92,76.66 26.21,85.95 39.62,85.95 48.77,76.81 48.77,75.89 U10.15
GND  (via drill 0.35)
  Top 0.152: 52.12,60.2 52.12,65.84 51.51,66.45 U10.12 | 52.12,60.2 52.12,57.15 51.51,56.54 51.51,49.99 U4.12 | 33.22,73.15 33.22,76.35 32.61,76.96 30.48,76.96 30.33,77.11 30.33,77.72 30.79,78.18 32.77,78.18 32.92,78.33 32.92,80.47 32.16,81.23 31.7,81.23 U2.7 | 33.22,73.15 33.22,70.41 32.77,69.95 31.7,69.95 U1.7 | v40.54,21.64 39.17,21.64 37.49,23.32 37.49,23.62 U5.12 | U3.8 59.59,55.78 59.59,52.73 53.95,47.09 53.95,35.97 50.9,32.92 50.9,31.39 51.36,30.94 U8.12 51.51,30.79 51.51,26.36 55.47,22.4 55.47,16.92 U$2.GND 57.45,15.24 59.44,13.26 59.44,12.04 52.58,5.18 29.26,5.18 U$4.NEG | v34.14,73.15 33.22,73.15 | v52.27,60.2 52.12,60.2
  Bottom 0.152: v40.54,21.64 45.11,17.07 51.36,17.07 53.19,15.24 U$2.GND | v34.14,73.15 39.32,73.15 v52.27,60.2 56.54,55.93 59.59,55.93 U3.8
NAND(D11,D12)  (via drill 0.35)
  Top 0.152: U1.3 30.79,64.77 29.11,63.09 v29.11,58.52 | v14.02,22.71 14.02,21.64 15.54,20.12 15.7,20.12 16.61,19.2 16.61,18.59 21.49,13.72 36.58,13.72 37.19,13.11 39.01,13.11 39.93,14.02 39.93,14.33 U5.15
  Bottom 0.152: v29.11,58.52 29.11,56.84 27.13,54.86 27.13,47.4 14.02,34.29 14.02,32.16 11.73,29.87 11.73,28.96 13.11,27.58 13.26,27.58 14.02,26.82 v14.02,22.71
NAND(D12,~D11)  (via drill 0.35)
  Top 0.152: v29.57,66.14 31.55,66.14 U1.4 | v28.35,67.36 27.74,67.97 25.76,67.97 25.45,68.28 25.45,70.26 v28.5,73.3 | v49.23,64.16 49.23,59.59 48.92,59.28 U4.15
  Bottom 0.152: v28.35,67.36 v29.57,66.14 | v28.5,73.3 31.85,73.3 32.92,74.37 39.01,74.37 v49.23,64.16
NAND(~D12,D11)  (via drill 0.35)
  Top 0.152: v39.78,71.32 38.1,73 38.1,78.64 34.59,82.14 30.48,82.14 27.74,79.4 25.76,79.4 25.15,78.79 25.15,68.12 25.91,67.36 26.67,67.36 U1.10 | v48.46,41.76 48.46,40.54 48.77,40.23 U8.15
  Bottom 0.152: v39.78,71.32 40.23,71.32 48.31,63.25 48.31,41.91 v48.46,41.76
VCC
  Top 0.152: U$2.RAW 57.15,12.65 55.63,12.65 53.19,10.21 29.26,10.21 U$4.POS
~D11  (via drill 0.35)
  Top 0.152: U1.12 25.91,64.77 v25.3,65.38 | U1.6 32,68.58 33.83,70.41 v33.83,71.93 34.75,72.85 34.75,75.29 32.61,77.42 31.7,77.42 U2.4
  Bottom 0.152: v25.3,65.38 25.3,67.67 29.26,71.63 33.53,71.63 v33.83,71.93
~D12
  Top 0.152: 28.19,68.43 28.04,68.58 U1.9 | 28.19,68.43 28.96,67.67 28.96,64.92 27.58,63.55 26.82,63.55 U1.13 | U2.3 31.24,76.2 29.57,74.52 29.57,71.32 29.11,70.87 29.11,69.34 28.19,68.43